# EAGLE design Lion1 (EAGLE 6.6.0)
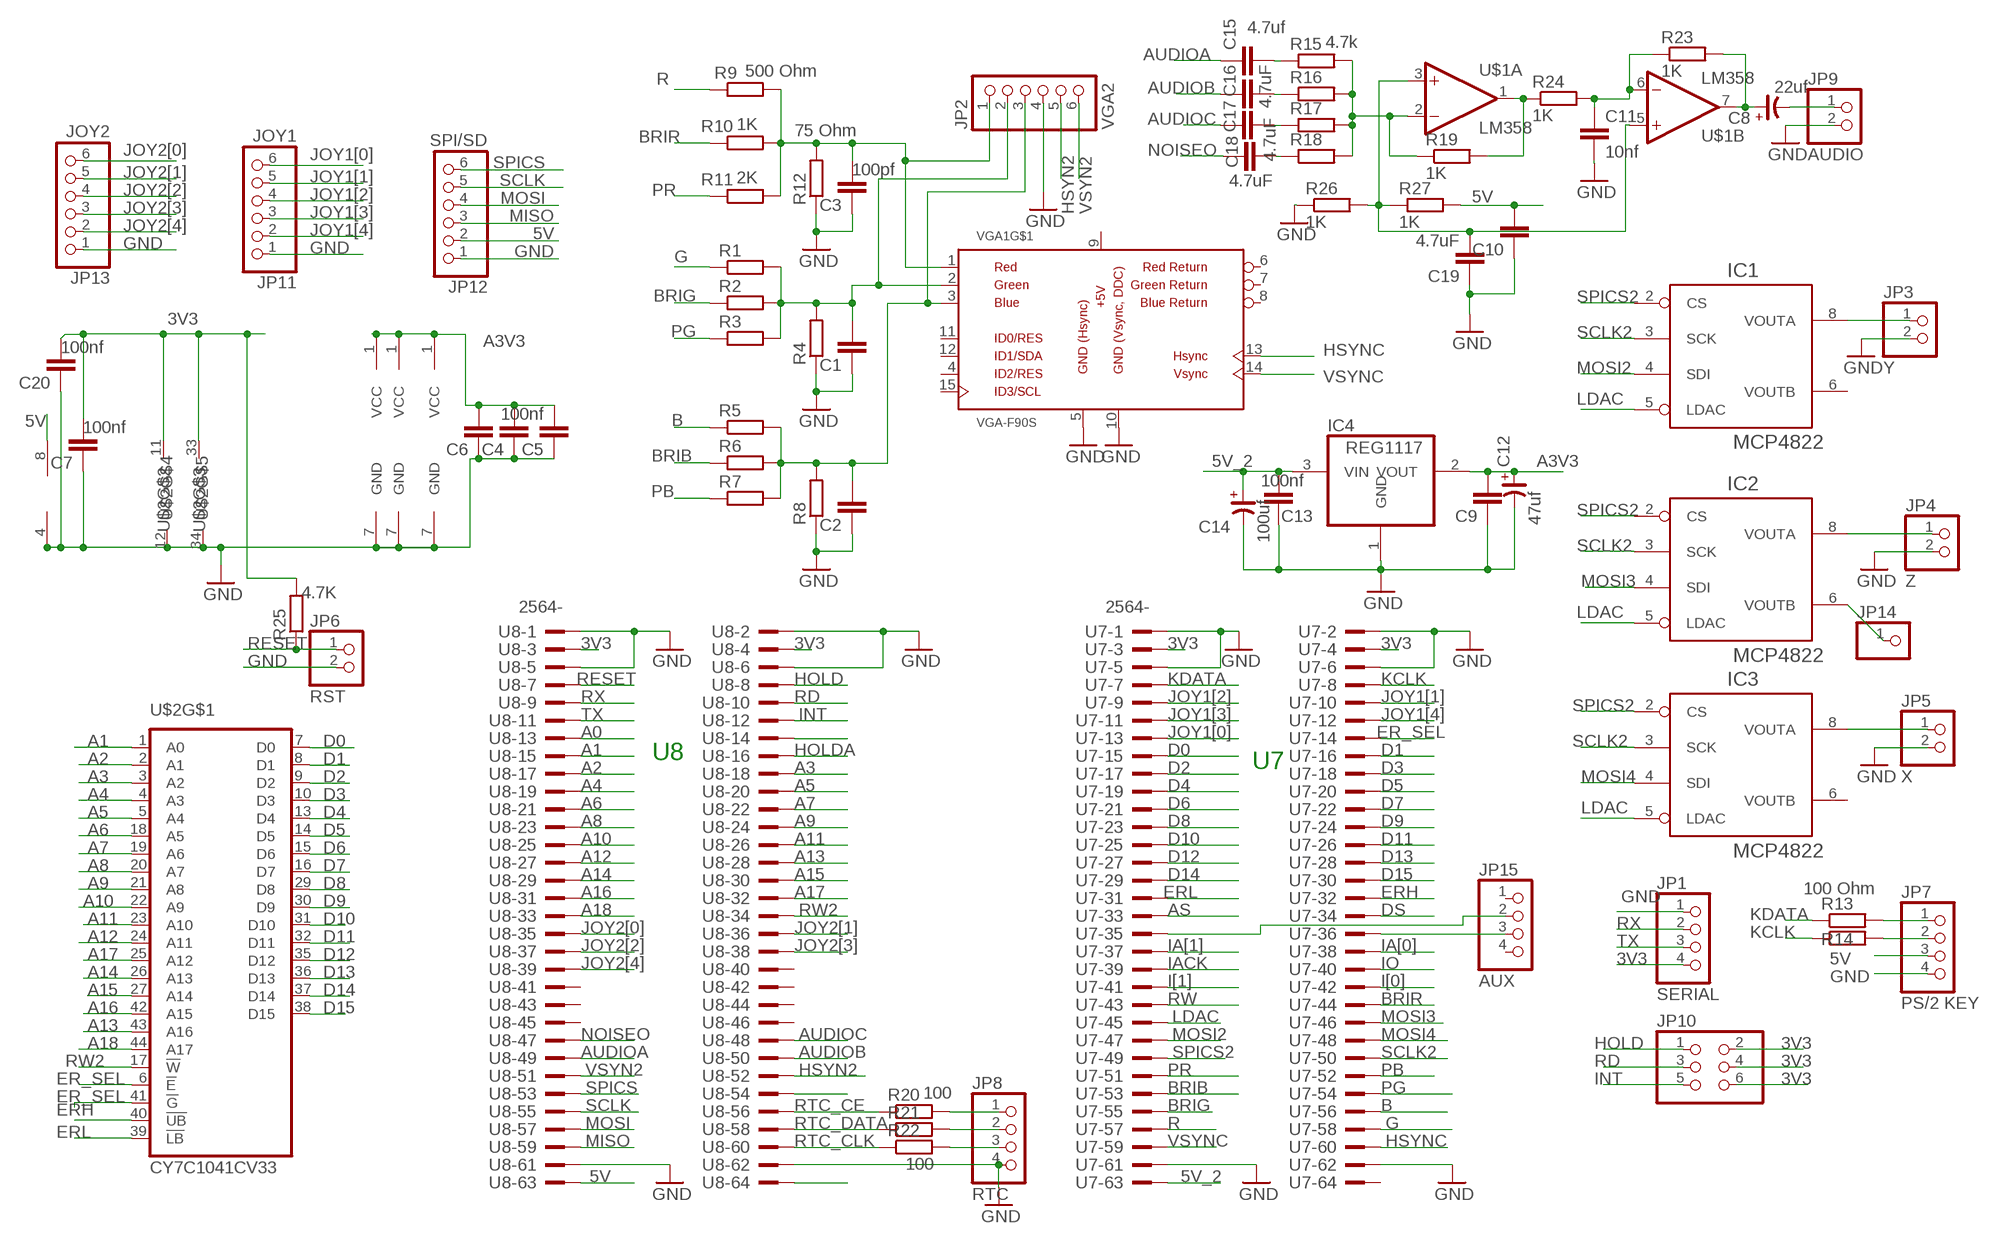
[diagram p0: schematic, sheet 1]

## Parts
C1  C-EU050-025X075  [C050-025X075]
C2  C-EU050-025X075  [C050-025X075]
C3  100pf  C-EU050-025X075  [C050-025X075]
C4  C-EU050-025X075  [C050-025X075]
C5  100nf  C-EU050-025X075  [C050-025X075]
C6  C-EU050-025X075  [C050-025X075]
C7  100nf  C-EUC0805  [C0805]
C8  22uf  CP_E-025X060  [CE-025X060]
C9  C-EU050-025X075  [C050-025X075]
C10  C-EU050-025X075  [C050-025X075]
C11  10nf  C-EU050-025X075  [C050-025X075]
C12  47uf  CP_E-025X060  [CE-025X060]
C13  100nf  C-EU050-025X075  [C050-025X075]
C14  100uf  CP_E-025X060  [CE-025X060]
C15  4.7uf  C-EU050-025X075  [C050-025X075]
C16  4.7uF  C-EU050-025X075  [C050-025X075]
C17  4.7uF  C-EU050-025X075  [C050-025X075]
C18  4.7uF  C-EU050-025X075  [C050-025X075]
C19  4.7uF  C-EU050-025X075  [C050-025X075]
C20  100nf  C-EUC0805  [C0805]
IC1  MCP4822  MCP42E-P  [DIL08]
IC2  MCP4822  MCP42E-P  [DIL08]
IC3  MCP4822  MCP42E-P  [DIL08]
IC4  REG1117  [SOT223]
JP1  SERIAL  PINHD-1X4  [1X04]
JP2  VGA2  PINHD-1X6  [1X06]
JP3  Y  PINHD-1X2  [1X02]
JP4  Z  PINHD-1X2  [1X02]
JP5  X  PINHD-1X2  [1X02]
JP6  RST  PINHD-1X2  [1X02]
JP7  PS/2 KEY  PINHD-1X4  [1X04]
JP8  RTC  PINHD-1X4  [1X04]
JP9  AUDIO  PINHD-1X2  [1X02]
JP10  PINHD-2X3  [2X03]
JP11  JOY1  PINHD-1X6  [1X06]
JP12  SPI/SD  PINHD-1X6  [1X06]
JP13  JOY2  PINHD-1X6  [1X06]
JP14  PINHD-1X1  [1X01]
JP15  AUX  PINHD-1X4  [1X04]
R1  R-EU_0204/7  [0204/7]
R2  R-EU_0204/7  [0204/7]
R3  R-EU_0204/7  [0204/7]
R4  R-EU_0204/7  [0204/7]
R5  R-EU_0204/7  [0204/7]
R6  R-EU_0204/7  [0204/7]
R7  R-EU_0204/7  [0204/7]
R8  R-EU_0204/7  [0204/7]
R9  500 Ohm  R-EU_0204/7  [0204/7]
R10  1K  R-EU_0204/7  [0204/7]
R11  2K  R-EU_0204/7  [0204/7]
R12  75 Ohm  R-EU_0204/7  [0204/7]
R13  100 Ohm  R-EU_0204/7  [0204/7]
R14  R-EU_0204/7  [0204/7]
R15  4.7k  R-EU_0204/2V  [0204V]
R16  R-EU_0204/2V  [0204V]
R17  R-EU_0204/2V  [0204V]
R18  R-EU_0204/2V  [0204V]
R19  1K  R-EU_0204/7  [0204/7]
R20  100  R-EU_0204/7  [0204/7]
R21  100  R-EU_0204/7  [0204/7]
R22  R-EU_0204/7  [0204/7]
R23  1K  R-EU_0204/7  [0204/7]
R24  1K  R-EU_0204/7  [0204/7]
R25  4.7K  R-EU_0204/5  [0204/5]
R26  1K  R-EU_0204/7  [0204/7]
R27  1K  R-EU_0204/7  [0204/7]
U7  2564-  [PAK100/2500-64]
U8  2564-  [PAK100/2500-64]
U$1  LM358  [DIL8]
U$2  CY7C1041CV33  [TSOP44-II]
VGA1  VGA-F90S  [DB-15-F90+SHIELD-SMALL_PADS]

## Nets
3V3: C7.2 C20.2 JP1.4 JP10.2 JP10.4 JP10.6 R25.2 U7.3 U7.4 U8.3 U8.4 U$2.11(VCC) U$2.33(VCC)
5V: C10.2 JP7.3 JP12.2 R27.2 U8.63 U$1.8(P:V+)
5V_2: C13.2 C14.+ IC4.3(VIN) U7.63
A0: U8.13
A1: U8.15 U$2.1(A0)
A2: U8.17 U$2.2(A1)
A3: U8.18 U$2.3(A2)
A3V3: C4.2 C5.2 C6.2 C9.2 C12.+ IC1.1(VCC) IC2.1(VCC) IC3.1(VCC) IC4.2(VOUT)
A4: U8.19 U$2.4(A3)
A5: U8.20 U$2.5(A4)
A6: U8.21 U$2.18(A5)
A7: U8.22 U$2.19(A6)
A8: U8.23 U$2.20(A7)
A9: U8.24 U$2.21(A8)
A10: U8.25 U$2.22(A9)
A11: U8.26 U$2.23(A10)
A12: U8.27 U$2.24(A11)
A13: U8.28 U$2.43(A16)
A14: U8.29 U$2.26(A13)
A15: U8.30 U$2.27(A14)
A16: U8.31 U$2.42(A15)
A17: U8.32 U$2.25(A12)
A18: U8.33 U$2.44(A17)
AS: U7.33
AUDIOA: C15.1 U8.49
AUDIOB: C16.1 U8.50
AUDIOC: C17.1 U8.48
B: R5.1 U7.56
BRIB: R6.1 U7.53
BRIG: R2.1 U7.55
BRIR: R10.1 U7.44
D0: U7.15 U$2.7(D0)
D1: U7.16 U$2.8(D1)
D2: U7.17 U$2.9(D2)
D3: U7.18 U$2.10(D3)
D4: U7.19 U$2.13(D4)
D5: U7.20 U$2.14(D5)
D6: U7.21 U$2.15(D6)
D7: U7.22 U$2.16(D7)
D8: U7.23 U$2.29(D8)
D9: U7.24 U$2.30(D9)
D10: U7.25 U$2.31(D10)
D11: U7.26 U$2.32(D11)
D12: U7.27 U$2.35(D12)
D13: U7.28 U$2.36(D13)
D14: U7.29 U$2.37(D14)
D15: U7.30 U$2.38(D15)
DS: U7.34
ER_SEL: U7.14 U$2.6(!E) U$2.41(!G)
ERH: U7.32 U$2.40(!UB)
ERL: U7.31 U$2.39(!LB)
G: R1.1 U7.58
GND: C1.1 C2.1 C3.1 C4.1 C5.1 C6.1 C7.1 C9.1 C10.1 C11.2 C12.- C13.1 C14.- C19.1 C20.1 IC1.7(GND) IC2.7(GND) IC3.7(GND) IC4.1(GND) JP1.1 JP2.4 JP3.2 JP4.2 JP5.2 JP6.2 JP7.4 JP8.4 JP9.2 JP11.1 JP12.1 JP13.1 R4.1 R8.1 R12.1 R26.1 U7.1 U7.2 U7.5 U7.6 U7.61 U7.62 U8.1 U8.2 U8.5 U8.6 U8.61 U8.62 U$1.4(P:V-) U$2.12(VSS) U$2.34(VSS) VGA1.5(GND) VGA1.10(GND)
HOLD: JP10.1 U8.8
HOLDA: U8.16
HSYN2: JP2.5 U8.52
HSYNC: U7.60 VGA1.13(VGA-HSYNC)
I[0]: U7.42
I[1]: U7.41
IA[0]: U7.38
IA[1]: U7.37
IACK: U7.39
INT: JP10.5 U8.12
IO: U7.40
JOY1[0]: JP11.6 U7.13
JOY1[1]: JP11.5 U7.10
JOY1[2]: JP11.4 U7.9
JOY1[3]: JP11.3 U7.11
JOY1[4]: JP11.2 U7.12
JOY2[0]: JP13.6 U8.35
JOY2[1]: JP13.5 U8.36
JOY2[2]: JP13.4 U8.37
JOY2[3]: JP13.3 U8.38
JOY2[4]: JP13.2 U8.39
KCLK: R14.1 U7.8
KDATA: R13.1 U7.7
LDAC: IC1.5(LDAC) IC2.5(LDAC) IC3.5(LDAC) U7.45
MISO: JP12.3 U8.59
MOSI: JP12.4 U8.57
MOSI2: IC1.4(SDI) U7.47
MOSI3: IC2.4(SDI) U7.46
MOSI4: IC3.4(SDI) U7.48
N$1: C1.2 JP2.2 R1.2 R2.2 R3.2 R4.2 VGA1.2(VGA-G)
N$2: IC2.6(VOUTB) JP14.1
N$3: C19.2 R26.2 R27.1 U$1.3(A:+IN) U$1.5(B:+IN)
N$4: C15.2 R15.1
N$5: IC3.8(VOUTA) JP5.1
N$6: C2.2 JP2.3 R5.2 R6.2 R7.2 R8.2 VGA1.3(VGA-B)
N$7: IC2.8(VOUTA) JP4.1
N$8: IC1.8(VOUTA) JP3.1
N$9: R15.2 R16.2 R17.2 R18.2 R19.1 U$1.2(A:-IN)
N$10: C3.2 JP2.1 R9.2 R10.2 R11.2 R12.2 VGA1.1(VGA-R)
N$11: R19.2 R24.1 U$1.1(A:OUT)
N$12: JP7.1 R13.2
N$13: JP7.2 R14.2
N$14: C8.- JP9.1
N$15: JP8.1 R20.2
N$17: JP8.2 R21.2
N$18: JP8.3 R22.2
N$19: C8.+ R23.2 U$1.7(B:OUT)
N$20: C11.1 R23.1 R24.2 U$1.6(B:-IN)
N$21: C16.2 R16.1
N$22: C17.2 R17.1
N$23: C18.2 R18.1
N$24: JP15.2 U7.35
N$47: U8.14
N$66: U8.54
N$70: U8.64
N$85: JP15.3 U7.36
NOISEO: C18.1 U8.47
PB: R7.1 U7.52
PG: R3.1 U7.54
PR: R11.1 U7.51
R: R9.1 U7.57
RD: JP10.3 U8.10
RESET: JP6.1 R25.1 U8.7
RTC_CE: R20.1 U8.56
RTC_CLK: R22.1 U8.60
RTC_DATA: R21.1 U8.58
RW: U7.43
RW2: U8.34 U$2.17(!W)
RX: JP1.2 U8.9
SCLK: JP12.5 U8.55
SCLK2: IC1.3(SCK) IC2.3(SCK) IC3.3(SCK) U7.50
SPICS: JP12.6 U8.53
SPICS2: IC1.2(CS) IC2.2(CS) IC3.2(CS) U7.49
TX: JP1.3 U8.11
VSYN2: JP2.6 U8.51
VSYNC: U7.59 VGA1.14(VGA-VSYNC)
Unconnected: IC1.6(VOUTB) IC3.6(VOUTB) JP15.1 JP15.4 U7.64 U8.40 U8.41 U8.42 U8.43 U8.44 U8.45 U8.46 VGA1.4(ID2/RES) VGA1.6(VGA-R-) VGA1.7(VGA-G-) VGA1.8(VGA-B-) VGA1.11(ID0/RES) VGA1.12(ID1/SDA) VGA1.15(ID3/SCL) VGA1.SHIELD@1(SHIELD) VGA1.SHIELD@2(SHIELD)

## Notes on the sheet
- U8
- U7

## Power pins joined to a net without a drawn wire
+5V: VGA1.9(+5V)

## Library data of the parts
C1-C7 C9-C11 C13 C15-C20 = rcl:C-EU: CAPACITOR, European symbol
C8 C12 C14 = rc-master:CP_: POLARIZED CAP
IC1-IC3 = dac:MCP4*2: DAC 8BIT DUAL SPI/VREF
IC4 = burr-brown:REG1117: 800mA and 1A Low Dropout (LDO) Positive Regulator 1.8V, 2.5V, 2.85V, 3.3V, 5V, and Adj; MPN: REG1117; OC_FARNELL: 1097566; OC_NEWARK: 14P6981
JP1 JP7 JP8 JP15 = pinhead:PINHD-1X4: PIN HEADER
JP2 JP11-JP13 = pinhead:PINHD-1X6: PIN HEADER
JP3-JP6 JP9 = pinhead:PINHD-1X2: PIN HEADER
JP10 = pinhead:PINHD-2X3: PIN HEADER
JP14 = pinhead:PINHD-1X1: PIN HEADER
R1-R12 R25 = rcl:R-EU_: RESISTOR, European symbol
R13-R24 R26 R27 = SmartPrj:R-EU_: RESISTOR, European symbol
U7 U8 = con-3m:2564-: 3M (TM) Pak 100 4-Wall Header Source: 3M; OC_FARNELL: unknown; OC_NEWARK: unknown
U$1 = eagle-6.5.0-atari:LM358: Dual General Purpose, Rail-to-Rail Output Operational Amplifier
U$2 = st-microelectronics:CY7C1041CV33
VGA1 = VideoConnectors:VGA-*

## Board
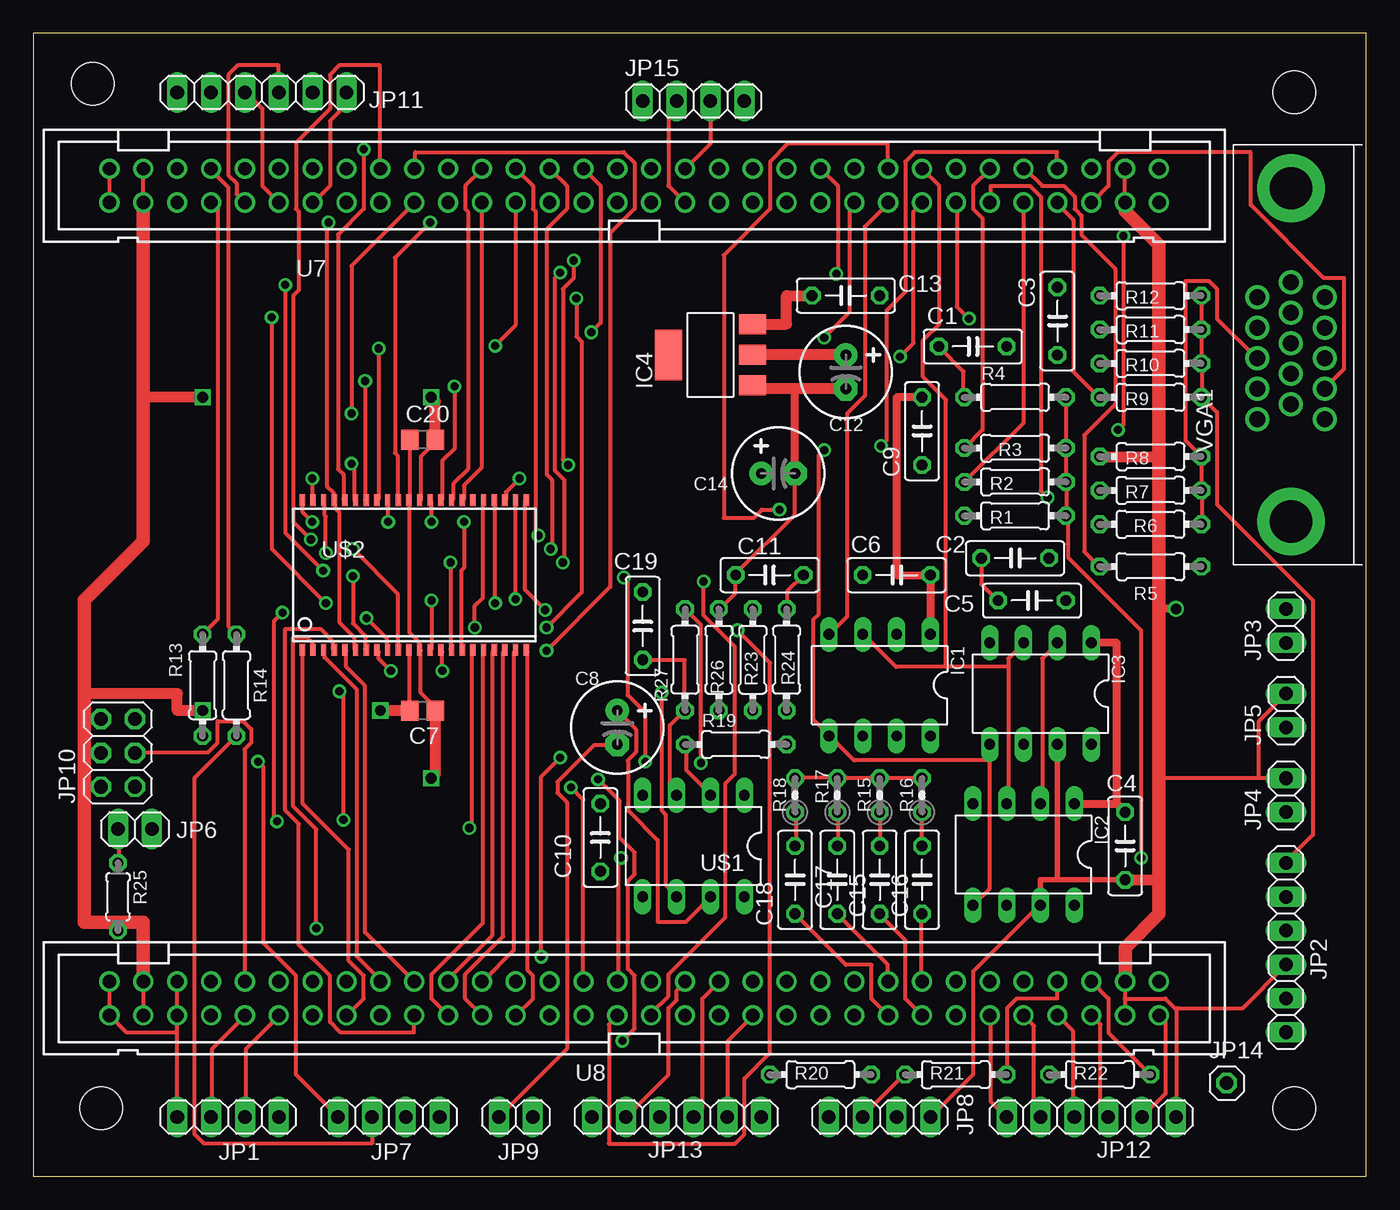
[diagram p1: board, top side]
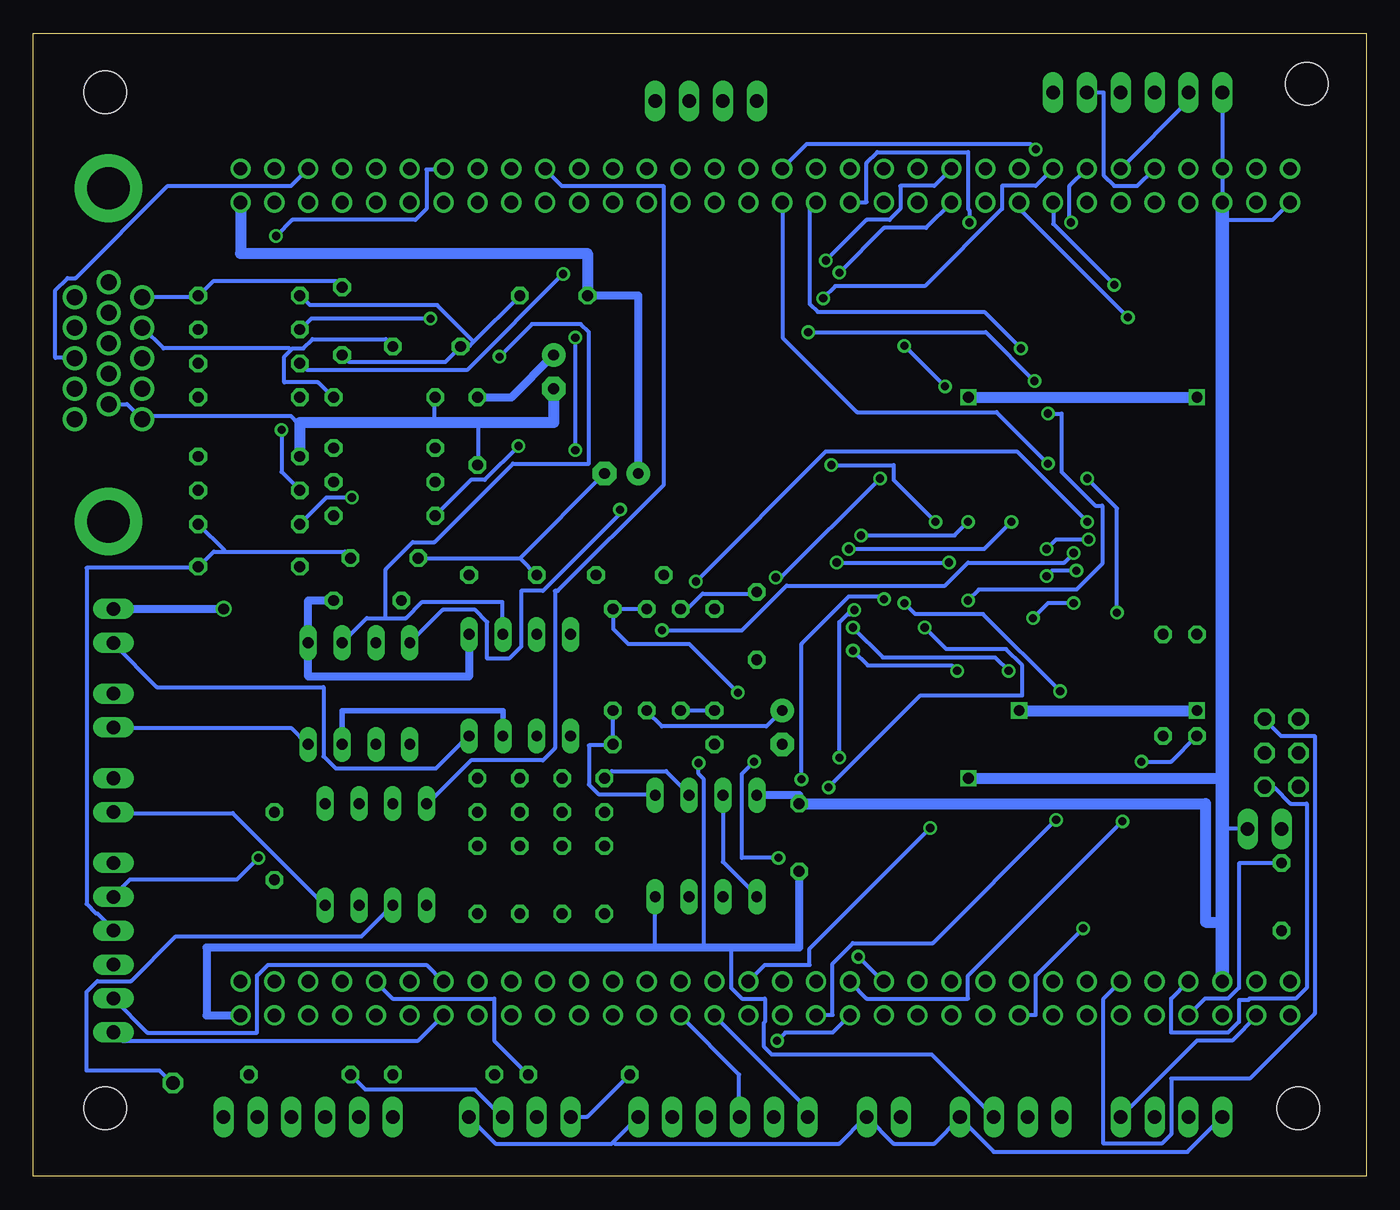
[diagram p2: board, bottom side, seen from below]

Size 100 x 85.72 mm. Coordinates in mm from the lower left corner, seen from the top.
Outline: 0,0 100,0 100,85.72 0,85.72 0,0
Copper layers (1*16): Top 0.035mm / dielectric 1.5mm / Bottom 0.035mm
Design rules "default *": minimum track width 12mil, minimum drill 24mil, track to track 12mil, track to pad 12mil, pad to pad 12mil, via to via 12mil, smd to smd 6mil, copper to edge 40mil, drill to drill 16mil, minimum pad ring 10mil, minimum via ring 8mil, stop-mask expansion 4mil, vias tented up to drill 0mil, thermal gap 10mil
Holes 3.2 mm at 94.61,81.28 94.61,5.08 4.45,81.92 5.08,5.08

### Footprints (pad centres in the part's own frame; a part is rotated, then mirrored left to right if it is on the bottom)
C050-025X075 = drill 0.813 octagon: 1 -2.54,0; 2 2.54,0
C0805 = smd 1.3 x 1.5: 1 -0.95,0; 2 0.95,0
CE-025X060 = drill 0.813 pad 1.778: + -1.27,0 | drill 0.813 pad 1.778 octagon: - 1.27,0
DIL08 = drill 0.813 long: 1 -3.81,-3.81; 2 -1.27,-3.81; 3 1.27,-3.81; 4 3.81,-3.81; 5 3.81,3.81; 6 1.27,3.81; 7 -1.27,3.81; 8 -3.81,3.81
SOT223 = smd 1.499 x 2.007: 1 -2.261,-3.15; 2 0.025,-3.15; 3 2.311,-3.15 | smd 3.81 x 2.007: 4 0,3.15
1X04 = drill 1.016 long: 1 -3.81,0; 2 -1.27,0; 3 1.27,0; 4 3.81,0
1X06 = drill 1.016 long: 1 -6.35,0; 2 -3.81,0; 3 -1.27,0; 4 1.27,0; 5 3.81,0; 6 6.35,0
1X02 = drill 1.016 long: 1 -1.27,0; 2 1.27,0
2X03 = drill 1.016 octagon: 1 -2.54,-1.27; 2 -2.54,1.27; 3 0,-1.27; 4 0,1.27; 5 2.54,-1.27; 6 2.54,1.27
1X01 = drill 1.016 octagon: 1 0,0
0204/7 = drill 0.813 octagon: 1 -3.81,0; 2 3.81,0
0204V = drill 0.813 octagon: 1 -1.27,0; 2 1.27,0
0204/5 = drill 0.813 octagon: 1 -2.54,0; 2 2.54,0
PAK100/2500-64 = drill 1 pad 1.422: 1 -39.37,-1.27; 2 -39.37,1.27; 3 -36.83,-1.27; 4 -36.83,1.27; 5 -34.29,-1.27; 6 -34.29,1.27; 7 -31.75,-1.27; 8 -31.75,1.27; 9 -29.21,-1.27; 10 -29.21,1.27; 11 -26.67,-1.27; 12 -26.67,1.27; 13 -24.13,-1.27; 14 -24.13,1.27; 15 -21.59,-1.27; 16 -21.59,1.27; 17 -19.05,-1.27; 18 -19.05,1.27; 19 -16.51,-1.27; 20 -16.51,1.27; 21 -13.97,-1.27; 22 -13.97,1.27; 23 -11.43,-1.27; 24 -11.43,1.27; 25 -8.89,-1.27; 26 -8.89,1.27; 27 -6.35,-1.27; 28 -6.35,1.27; 29 -3.81,-1.27; 30 -3.81,1.27; 31 -1.27,-1.27; 32 -1.27,1.27; 33 1.27,-1.27; 34 1.27,1.27; 35 3.81,-1.27; 36 3.81,1.27; 37 6.35,-1.27; 38 6.35,1.27; 39 8.89,-1.27; 40 8.89,1.27; 41 11.43,-1.27; 42 11.43,1.27; 43 13.97,-1.27; 44 13.97,1.27; 45 16.51,-1.27; 46 16.51,1.27; 47 19.05,-1.27; 48 19.05,1.27; 49 21.59,-1.27; 50 21.59,1.27; 51 24.13,-1.27; 52 24.13,1.27; 53 26.67,-1.27; 54 26.67,1.27; 55 29.21,-1.27; 56 29.21,1.27; 57 31.75,-1.27; 58 31.75,1.27; 59 34.29,-1.27; 60 34.29,1.27; 61 36.83,-1.27; 62 36.83,1.27; 63 39.37,-1.27; 64 39.37,1.27
DIL8 = drill 0.813 long: 1 -3.81,-3.81; 2 -1.27,-3.81; 3 1.27,-3.81; 4 3.81,-3.81; 5 3.81,3.81; 6 1.27,3.81; 7 -1.27,3.81; 8 -3.81,3.81
TSOP44-II = smd 0.4 x 0.9: 1 -8.4,-5.6; 2 -7.6,-5.6; 3 -6.8,-5.6; 4 -6,-5.6; 5 -5.2,-5.6; 6 -4.4,-5.6; 7 -3.6,-5.6; 8 -2.8,-5.6; 9 -2,-5.6; 10 -1.2,-5.6; 11 -0.4,-5.6; 12 0.4,-5.6; 13 1.2,-5.6; 14 2,-5.6; 15 2.8,-5.6; 16 3.6,-5.6; 17 4.4,-5.6; 18 5.2,-5.6; 19 6,-5.6; 20 6.8,-5.6; 21 7.6,-5.6; 22 8.4,-5.6; 23 8.4,5.6; 24 7.6,5.6; 25 6.8,5.6; 26 6,5.6; 27 5.2,5.6; 28 4.4,5.6; 29 3.6,5.6; 30 2.8,5.6; 31 2,5.6; 32 1.2,5.6; 33 0.4,5.6; 34 -0.4,5.6; 35 -1.2,5.6; 36 -2,5.6; 37 -2.8,5.6; 38 -3.6,5.6; 39 -4.4,5.6; 40 -5.2,5.6; 41 -6,5.6; 42 -6.8,5.6; 43 -7.6,5.6; 44 -8.4,5.6
DB-15-F90+SHIELD-SMALL_PADS = drill 1.2 pad 1.524: 1 4.318,14.224; 2 2.032,14.224; 3 -0.254,14.224; 4 -2.54,14.224; 5 -4.826,14.224; 6 5.461,11.684; 7 3.175,11.684; 8 0.889,11.684; 9 -1.397,11.684; 10 -3.683,11.684; 11 4.318,9.144; 12 2.032,9.144; 13 -0.254,9.144; 14 -2.54,9.144; 15 -4.826,9.144 | drill 3.175 pad 5.08: SHIELD@1 -12.497,11.684; SHIELD@2 12.497,11.684

### Placement (x,y rotation side)
C1  70.48,62.23 0 top
C2  73.66,46.35 0 top
C3  76.83,64.14 90 top
C4  81.92,24.77 90 top
C5  74.93,43.18 0 top
C6  64.77,45.09 0 top
C7  29.21,34.92 180 top
C8  43.81,33.66 270 top
C9  66.67,55.88 90 top
C10  42.55,25.4 270 top
C11  55.24,45.09 180 top
C12  60.96,60.33 270 top
C13  60.96,66.04 180 top
C14  55.88,52.7 0 top
C15  63.5,22.23 90 top
C16  66.67,22.23 90 top
C17  60.33,22.23 90 top
C18  57.15,22.23 90 top
C19  45.72,41.27 270 top
C20  29.21,55.24 0 top
IC1  63.5,36.83 180 top
IC2  74.3,24.13 180 top
IC3  75.56,36.2 180 top
IC4  50.8,61.59 90 top
JP1  14.61,4.45 0 top
JP2  93.98,17.14 270 top
JP3  93.98,41.27 90 top
JP4  93.98,28.57 90 top
JP5  93.98,34.92 90 top
JP6  7.62,26.04 0 top
JP7  26.67,4.45 0 top
JP8  63.5,4.45 0 top
JP9  36.2,4.45 0 top
JP10  6.35,31.75 90 top
JP11  17.14,81.28 0 top
JP12  79.38,4.45 180 top
JP13  48.26,4.45 180 top
JP14  89.53,6.99 0 top
JP15  49.53,80.64 0 top
R1  73.66,49.53 0 top
R2  73.66,52.07 0 top
R3  73.66,54.61 0 top
R4  73.66,58.42 0 top
R5  83.82,45.72 0 top
R6  83.82,48.9 0 top
R7  83.82,51.44 0 top
R8  83.82,53.98 0 top
R9  83.82,58.42 0 top
R10  83.82,60.96 0 top
R11  83.82,63.5 0 top
R12  83.82,66.04 0 top
R13  12.7,36.83 270 top
R14  15.24,36.83 270 top
R15  63.5,28.57 90 top
R16  66.67,28.57 90 top
R17  60.33,28.57 90 top
R18  57.15,28.57 90 top
R19  52.7,32.38 0 top
R20  59.05,7.62 180 top
R21  69.22,7.62 180 top
R22  80.01,7.62 180 top
R23  53.98,38.73 270 top
R24  56.52,38.73 90 top
R25  6.35,20.95 270 top
R26  51.44,38.73 270 top
R27  48.9,38.73 90 top
U7  45.09,74.3 0 top
U8  45.09,13.34 0 top
U$1  49.53,24.77 180 top
U$2  28.57,45.09 0 top
VGA1  106.05,61.59 90 top

### Tracks (layer width: path | path; a pad name or v marks a point on that pad's centre or on a via)
3V3  (via drill 0.8)
  Top 0.305: U$2.11 28.25,39.42 28.25,35.26 C7.2 | U$2.33 29.06,50.7 29.06,53.95 29.97,54.86 C20.2 | R25.2 6.4,18.49 6.4,19.05 | U8.3 8.23,12.09 8.23,14.12 U8.4 | U7.4 8.23,75.49 8.23,73.46 U7.3 | 3.81,29.26 5.08,29.26 JP10.2 | 3.81,31.8 5.08,31.8 JP10.4 | 3.81,34.34 5.08,34.34 JP10.6
  Top 0.813: C7.2 v26.04,34.92 | C20.2 30.16,58.1 v29.84,58.42 | v12.7,34.92 10.79,34.92 10.79,36.2 3.81,36.2 | v12.7,58.42 8.26,58.42
  Top 1.016: U8.4 8.26,19.05 6.4,19.05 3.81,19.05 3.81,29.26 3.81,31.8 3.81,34.34 3.81,36.2 3.81,43.18 8.26,47.62 8.26,58.42 U7.3
  Bottom 0.305: JP1.4 12.7,10.16 10.06,10.16 8.23,11.99 U8.3
  Bottom 0.813: v26.04,34.92 v12.7,34.92 | v29.84,58.42 v12.7,58.42
5V  (via drill 0.61)
  Top 0.305: R27.2 50.09,41.35 v50.09,30.99 | JP12.2 84.94,6.2 84.94,11.58 U8.63
  Bottom 0.305: 53.34,17.14 U$1.8 | v50.09,30.99 50.09,30.18 49.68,29.77 49.68,17.14 | 47.65,17.14 47.65,14.12 46.84,13.31 45.11,13.31 45.11,11.58 45.21,11.48 45.21,9.75 44.6,9.14 32.61,9.14 27.94,4.47 JP7.3
  Bottom 0.61: C10.2 42.55,17.14 47.65,17.14 49.68,17.14 53.34,17.14 87,17.14 87,12.06 U8.63
5V_2
  Top 0.813: IC4.3 56.52,63.91 56.52,66.04 C13.2
  Bottom 0.61: C14.+ 54.61,66.04 C13.2
  Bottom 0.813: U7.63 84.45,69.22 58.42,69.22 C13.2
A1
  Top 0.305: U$2.1 20.22,39.42 20.22,27.94 23.67,24.49 23.67,16.15 24.79,15.04 24.79,13.31 23.57,12.09 U8.15
A2  (via drill 0.61)
  Top 0.305: v21.23,18.59 21.23,26.01 19.51,27.74 19.51,40.44 20.52,40.44 20.93,40.03 20.93,39.52 U$2.2
  Bottom 0.305: v21.23,18.59 24.79,15.04 24.79,12.09 26.01,12.09 U8.17
A3
  Top 0.305: U$2.3 21.84,39.42 21.84,38.91 24.28,36.47 24.28,16.46 26.01,14.73 26.01,14.63 U8.18
A3V3
  Top 0.61: C4.2 81.28,27.94 | 81.28,27.94 81.28,40.01 IC3.1 | C9.2 64.77,58.42 64.77,45.09 C6.2 IC1.1 | IC2.1 81.28,27.94
  Top 0.813: C12.+ 60.3,61.59 IC4.2
  Bottom 0.61: C5.2 79.38,43.18 IC3.1 79.38,37.47 67.31,37.47 IC1.1 | C9.2 64.14,58.42 C12.+
A4
  Top 0.305: U$2.4 22.55,39.52 22.45,39.62 22.45,40.13 21.54,41.05 18.9,41.05 18.9,27.43 19.91,26.42 19.91,17.37 22.25,15.04 22.25,11.58 23.06,10.77 28.55,10.77 28.55,11.99 U8.19
A5
  Top 0.305: U8.20 24.89,18.29 24.89,36.78 23.47,38.2 23.47,39.42 U$2.5
A6
  Top 0.305: U8.21 29.87,13.31 29.87,15.14 33.73,19 33.73,39.42 U$2.18
A7
  Top 0.305: U$2.19 34.54,39.42 34.44,39.32 34.44,18.09 31.19,14.83 31.19,14.63 U8.22
A8
  Top 0.305: U8.23 32.41,13.31 32.41,15.14 35.26,17.98 35.26,39.32 35.36,39.42 U$2.20
A9
  Top 0.305: U$2.21 36.17,39.42 36.07,39.32 36.07,16.97 33.73,14.63 U8.24
A10
  Top 0.305: U$2.22 36.98,39.42 37.08,39.32 37.08,15.44 37.49,15.04 37.49,13.31 36.27,12.09 U8.25
A11  (via drill 0.61)
  Top 0.305: v38.41,42.47 36.88,43.99 36.88,50.6 U$2.23 | v39.52,31.39 38.1,29.97 v38.1,16.46
  Bottom 0.305: v38.41,42.47 38.71,42.16 38.91,42.16 39.52,41.55 v39.52,31.39 | v38.1,16.46 36.27,14.63 U8.26
A12  (via drill 0.61)
  Top 0.305: v36.17,43.28 36.17,50.6 U$2.24 | v42.37,29.77 43.99,28.14 43.99,25.4 45.11,24.28 45.11,22.66 44.6,22.15 44.6,15.54 45.11,15.04 45.11,11.07 v44.2,10.16
  Bottom 0.305: v36.17,43.28 36.37,43.48 38.81,43.48 42.37,39.93 v42.37,29.77 | v44.2,10.16 43.59,10.77 40.03,10.77 U8.27
A13  (via drill 0.61)
  Top 0.305: v20.93,52.32 20.93,50.7 U$2.43 | v18.69,42.27 18.09,41.66 18.09,26.82 v18.29,26.62
  Bottom 0.305: v20.93,52.32 18.69,50.09 v18.69,42.27 | v18.29,26.62 29.87,15.04 29.87,13.31 37.49,13.31 38.71,14.53 U8.28
A14  (via drill 0.61)
  Top 0.305: v34.65,42.98 34.65,50.6 U$2.26 | v22.96,36.37 23.27,36.07 v23.27,26.72
  Bottom 0.305: v34.65,42.98 33.83,42.16 28.75,42.16 v22.96,36.37 | v23.27,26.72 32.51,17.48 38.51,17.48 40.03,15.95 40.03,12.09 41.25,12.09 U8.29
A15  (via drill 0.61)
  Top 0.305: v33.12,41.15 33.12,42.77 33.73,43.38 33.73,50.6 U$2.27 | v40.34,29.16 41.25,28.25 41.25,14.63 U8.30
  Bottom 0.305: v33.12,41.15 31.5,39.52 27.03,39.52 25.81,38.3 25.81,36.07 33.43,36.07 v40.34,29.16
A16  (via drill 0.61)
  Top 0.305: v21.95,46.74 21.95,49.48 21.84,49.58 21.84,50.6 U$2.42 | v52.83,40.95 55.27,38.51 55.27,9.25 53.34,7.32 53.34,3.15 52.63,2.44 43.18,2.44 43.18,11.38 43.79,11.99 U8.31
  Bottom 0.305: v21.95,46.74 22.66,46.02 29.87,46.02 31.6,44.3 43.48,44.3 46.84,40.95 v52.83,40.95
A17  (via drill 0.61)
  Top 0.305: v36.47,52.32 35.46,51.31 35.46,50.7 U$2.25 | v44.3,44.91 44.6,44.6 44.6,36.07 45.92,34.75 v45.92,31.09 | v44.09,23.88 43.89,23.67 43.89,14.63 U8.32
  Bottom 0.305: v36.47,52.32 43.89,44.91 v44.3,44.91 | v45.92,31.09 46.84,30.18 46.84,23.88 v44.09,23.88
A18  (via drill 0.61)
  Top 0.305: v20.93,49.07 20.22,49.78 20.22,50.6 U$2.44 | v50.29,44.6 50.29,42.06 52.63,39.73 52.63,30.18 51.92,29.46 51.92,19.41 47.65,15.14 47.65,13.51 46.43,12.29 46.43,12.09 U8.33
  Bottom 0.305: v20.93,49.07 26.21,54.36 40.54,54.36 v50.29,44.6
AUDIOA
  Top 0.305: U8.49 65.43,13.31 65.43,17.68 63.5,19.61 C15.1
AUDIOB
  Top 0.305: C16.1 66.65,19.61 66.65,14.63 U8.50
AUDIOC
  Top 0.305: C17.1 60.35,19.61 64.11,15.85 64.11,14.63 U8.48
B
  Top 0.305: R5.1 79.96,45.72 78.84,46.84 78.84,55.58 81.18,57.91 81.18,68.07 78.64,70.61 78.64,72.03 78.13,72.54 78.13,73.46 77.32,74.27 75.69,74.27 74.37,75.59 U7.56
BRIB  (via drill 0.61)
  Top 0.305: v76.1,50.9 75.59,51.41 75.59,73.46 74.78,74.27 71.83,74.27 71.83,73.05 U7.53
  Bottom 0.305: v76.1,50.9 78.03,50.9 79.96,48.97 R6.1
BRIG
  Top 0.305: R2.1 74.27,56.49 74.27,72.95 U7.55
BRIR  (via drill 0.61)
  Top 0.305: v60.25,67.67 60.35,67.77 60.35,74.27 U7.44
  Bottom 0.305: v60.25,67.67 67.46,60.45 79.45,60.45 79.96,60.96 R10.1
D0  (via drill 0.61)
  Top 0.305: v23.98,45.01 23.98,41.45 24.89,40.54 24.89,39.52 U$2.7 | v21.74,45.41 18.9,48.26 v18.9,66.85
  Bottom 0.305: v23.98,45.01 23.57,45.41 v21.74,45.41 | v18.9,66.85 23.47,71.42 23.47,72.95 U7.15
D1  (via drill 0.61)
  Top 0.305: v26.82,37.9 25.91,38.81 25.91,39.32 25.81,39.42 U$2.8 | v38.51,41.15 41.15,43.79 41.15,62.59 40.74,62.99 v40.74,65.84
  Bottom 0.305: v26.82,37.9 27.84,38.91 36.27,38.91 v38.51,41.15 | v40.74,65.84 39.83,66.75 33.12,66.75 27.33,72.54 27.33,74.27 24.79,74.27 U7.16
D2  (via drill 0.61)
  Top 0.305: v24.99,41.86 26.52,40.34 26.52,39.52 U$2.9 | v21.95,42.98 17.88,47.04 v17.88,64.41
  Bottom 0.305: v24.99,41.86 23.88,42.98 v21.95,42.98 | v17.88,64.41 26.01,72.54 26.01,72.95 U7.17
D3  (via drill 0.61)
  Top 0.305: v23.98,47.04 27.33,43.69 27.33,39.52 U$2.10 | v20.83,47.75 19.51,49.07 19.51,66.04 19.91,66.45 19.91,72.34 19.71,72.54 19.71,77.52 22.25,80.06 22.25,82.6 22.96,83.31 26.01,83.31 26.01,75.59 U7.18
  Bottom 0.305: v23.98,47.04 23.27,47.75 v20.83,47.75
D4  (via drill 0.61)
  Top 0.305: v29.87,43.18 29.87,39.52 U$2.13 | v23.88,57.2 23.88,68.28 28.55,72.95 U7.19
  Bottom 0.305: v29.87,43.18 29.06,43.99 21.74,43.99 19.81,45.92 19.81,50.29 20.32,50.29 22.86,52.83 22.86,57.2 v23.88,57.2
D5  (via drill 0.61)
  Top 0.305: v30.68,37.9 30.68,39.32 30.58,39.42 U$2.14 | v38.51,39.42 43.28,44.2 43.28,70.71 45.11,72.54 45.11,76 44.3,76.81 28.65,76.81 28.65,75.59 U7.20
  Bottom 0.305: v30.68,37.9 31.09,38.3 37.39,38.3 v38.51,39.42
D6  (via drill 0.61)
  Top 0.305: v31.29,46.02 31.29,39.52 U$2.15 | v39.73,46.02 39.83,46.13 39.83,52.22 39.12,52.93 39.12,67.36 v39.52,67.77
  Bottom 0.305: v39.73,46.02 v31.29,46.02 | v39.52,67.77 36.17,71.12 33.02,71.12 U7.21
D7  (via drill 0.61)
  Top 0.305: v32.31,49.07 32.31,45.62 32.11,45.41 32.11,39.52 U$2.16 | v40.13,53.34 39.73,53.75 39.73,66.55 40.54,67.36 v40.54,68.68
  Bottom 0.305: v32.31,49.07 35.46,52.22 35.46,53.34 v40.13,53.34 | v40.54,68.68 37.49,71.73 35.76,71.73 34.95,72.54 34.95,74.27 32.41,74.27 U7.22
D8
  Top 0.305: U$2.29 32.21,50.7 32.31,50.8 32.31,51.82 33.63,53.14 33.63,72.95 U7.23
D9
  Top 0.305: U$2.30 31.39,50.7 31.5,50.8 31.5,51.92 32.61,53.03 32.61,72.34 32.41,72.54 32.41,74.27 33.63,75.49 U7.24
D10  (via drill 0.61)
  Top 0.305: v31.6,59.23 31.6,54.56 30.68,53.65 30.68,50.8 30.58,50.7 U$2.31 | v34.65,62.28 36.17,63.8 36.17,72.95 U7.25
  Bottom 0.305: v34.65,62.28 v31.6,59.23
D11  (via drill 0.61)
  Top 0.305: v29.87,49.07 29.87,50.6 U$2.32 | v37.9,48.06 37.69,48.26 37.69,72.34 37.49,72.54 37.49,74.27 U7.26
  Bottom 0.305: v29.87,49.07 30.89,48.06 v37.9,48.06
D12  (via drill 0.61)
  Top 0.305: v29.77,71.53 27.13,68.89 27.13,54.25 27.33,54.05 27.33,50.7 U$2.35
  Bottom 0.305: v29.77,71.53 29.77,72.44 29.87,72.54 29.87,76.81 36.68,76.81 37.49,76 37.49,73.05 38.71,73.05 U7.27
D13  (via drill 0.61)
  Top 0.305: v26.62,49.07 26.62,50.6 U$2.36 | v38.81,47.04 38.91,47.14 38.91,52.22 38.51,52.63 38.51,71.02 40.03,72.54 40.03,74.27 U7.28
  Bottom 0.305: v26.62,49.07 28.65,47.04 v38.81,47.04
D14  (via drill 0.61)
  Top 0.305: v25.91,62.08 25.91,50.8 25.81,50.7 U$2.37
  Bottom 0.305: v25.91,62.08 28.65,64.82 41.15,64.82 41.76,65.43 41.76,72.95 41.35,72.95 U7.29
D15  (via drill 0.61)
  Top 0.305: v24.89,59.64 24.89,50.7 U$2.38 | v41.86,63.3 42.57,64.01 42.57,74.27 U7.30
  Bottom 0.305: v24.89,59.64 28.55,63.3 v41.86,63.3
ER_SEL  (via drill 0.61)
  Top 0.305: U$2.6 24.08,39.52 24.08,40.44 22.96,41.55 22.96,49.78 22.66,50.09 22.66,50.6 U$2.41 22.55,50.8 22.55,51.21 22.05,51.71 22.05,71.42 v22.15,71.53
  Bottom 0.305: U7.14 22.25,74.27 22.25,71.53 v22.15,71.53
ERH  (via drill 0.61)
  Top 0.305: v24.79,77.01 24.79,72.54 22.86,70.61 22.86,53.03 23.27,52.63 23.27,50.8 23.37,50.7 U$2.40
  Bottom 0.305: v24.79,77.01 25.2,77.42 41.96,77.42 U7.32
ERL  (via drill 0.61)
  Top 0.305: v23.88,53.44 24.08,53.24 24.08,50.7 U$2.39
  Bottom 0.305: v23.88,53.44 27.74,57.3 38.2,57.3 43.79,62.89 43.79,72.95 U7.31
G  (via drill 0.61)
  Top 0.305: v63.6,54.76 64.01,55.17 64.01,64.92 65.43,66.34 65.43,76.1 66.14,76.81 76.81,76.81 76.81,75.59 U7.58
  Bottom 0.305: R1.1 67.16,52.22 66.14,52.22 v63.6,54.76
GND  (via drill 0.8, 0.8 pad 1.02)
  Top 0.305: U7.1 5.69,73.05 5.69,75.49 U7.2 | U8.2 5.69,14.53 5.69,12.09 U8.1 7.01,10.77 10.77,10.77 | C20.1 28.25,55.17 28.25,50.7 U$2.34 28.25,50.6 28.25,40.74 28.96,40.03 28.96,39.62 U$2.12 29.06,39.42 29.06,36.27 29.97,35.36 29.97,35.26 C7.1 | U8.6 10.77,14.53 10.77,12.09 U8.5 10.77,11.99 10.77,10.77 | 10.77,10.77 10.77,4.47 JP1.1 | C2.1 71.12,44.4 72.34,43.18 C5.1 | R26.1 51.51,42.57 52.63,43.69 52.63,45.01 C11.2 52.73,45.21 57.1,49.58 57.1,52.43 C14.- | C1.1 67.97,62.18 69.8,60.35 69.8,58.42 R4.1 | 81.89,13.31 81.89,14.12 U8.62 | 81.89,13.31 81.89,12.09 U8.61 | U7.62 81.89,75.49 81.89,73.46 U7.61 | 85.75,12.5 85.75,4.47 JP12.1 | 85.75,12.5 84.94,13.31 81.89,13.31 | JP2.4 93.98,15.85 90.73,12.6 85.85,12.6 85.75,12.5 | 84.45,29.87 91.95,29.87 | 91.95,29.87 93.98,29.87 JP4.2 | 91.95,29.87 91.95,34.14 93.98,36.17 JP5.2 | JP8.4 67.36,4.47 70.51,7.62 70.51,15.34 75.39,20.22 IC2.7
  Top 0.406: C4.1 76.83,22.23 | 76.83,22.23 IC3.7 | 76.83,22.23 75.56,22.23 IC2.7
  Top 0.61: C14.- 57.15,59.05 | v85.72,42.55 84.45,42.55
  Top 0.813: C4.1 84.45,22.23 | C12.- 57.15,59.05 54.59,59.05 IC4.1 | R8.1 84.45,53.98 | C7.1 30.16,30.16 v29.84,29.84
  Top 1.016: U7.61 81.92,72.39 84.45,69.85 84.45,53.98 84.45,42.55 84.45,29.87 84.45,22.23 84.45,19.68 81.92,17.14 U8.62
  Bottom 0.305: C10.1 42.37,28.25 42.37,28.35 42.55,28.57 | U7.5 10.77,73.46 10.77,75.49 U7.6 10.77,75.69 10.77,81.28 JP11.1 | JP6.2 8.94,26.11 10.36,26.11 10.79,26.04 | U7.1 7.01,71.73 10.79,71.73 | 56.49,2.54 56.59,2.44 65.33,2.44 67.26,4.37 JP8.4 | 56.49,2.54 54.66,4.37 JP13.1 | 56.49,2.54 56.39,2.44 39.52,2.44 37.59,4.37 JP9.2 35.46,2.44 32.41,2.44 30.48,4.37 JP7.4 30.38,4.27 27.94,1.83 13.41,1.83 JP1.1 | 63.5,46.33 62.28,45.11 C6.1 | 63.5,46.33 71.12,46.33 C2.1 | C19.1 45.72,43.79 45.82,43.69 49.78,43.69 50.9,42.57 51.41,42.57 R26.1 | VGA1.10 92.96,57.91 VGA1.5 91.75,56.9 91.64,57 80.67,57 80.37,56.69 80.01,56.52 | 66.65,56.52 66.65,53.34 C9.1 | 69.9,56.52 69.9,58.42 R4.1 | C3.1 76.3,61.06 69.09,61.06 67.97,62.18 C1.1 67.87,62.28 67.26,62.28 66.95,62.59 | 66.95,62.59 C13.1 | 66.95,62.59 69.7,65.33 79.25,65.33 79.96,66.04 R12.1 | 63.5,46.33 57.2,52.63 C14.-
  Bottom 0.406: IC3.7 76.83,34.92 64.77,34.92 IC1.7
  Bottom 0.61: 42.55,28.57 U$1.4 | JP3.2 v85.72,42.55
  Bottom 0.813: 10.79,26.67 10.79,26.04 | C12.- 60.96,56.52 66.65,56.52 69.9,56.52 80.01,56.52 R8.1 | v29.84,29.84 10.79,29.84 | 10.79,19.05 12.06,19.05 12.06,27.94 C10.1
  Bottom 1.016: U8.6 10.79,19.05 10.79,26.04 10.79,29.84 10.79,71.73 U7.5
HOLD
  Bottom 0.305: U8.8 14.63,13.31 14.63,10.77 10.36,10.77 9.55,11.58 9.55,13.21 8.84,13.21 8.74,13.31 5.28,13.31 4.47,14.12 4.47,27.94 5.69,27.94 6.91,29.16 7.62,29.16 JP10.1
HSYN2
  Bottom 0.305: U8.52 69.29,14.63 70.51,15.85 82.4,15.85 83.21,15.04 83.21,10.77 91.44,10.77 93.98,13.31 JP2.5
HSYNC
  Bottom 0.305: U7.60 80.67,74.27 89.92,74.27 96.83,67.36 97.43,67.36 98.35,66.45 98.35,61.37 96.93,61.37 VGA1.13
INT
  Bottom 0.305: U8.12 19.71,13.31 19.71,2.44 15.34,2.44 14.63,3.15 14.63,7.32 8.74,7.32 3.86,12.19 3.86,33.02 6.4,33.02 7.62,34.24 JP10.5
JOY1[0]
  Top 0.305: U7.13 21.03,73.05 22.25,74.27 22.25,79.15 23.47,80.37 23.47,81.28 JP11.6
JOY1[1]
  Bottom 0.305: U7.10 17.17,74.27 18.9,74.27 19.71,75.08 19.71,81.28 JP11.5
JOY1[2]
  Top 0.305: U7.9 15.24,73.66 15.24,74.47 14.63,75.08 14.63,82.6 15.34,83.31 18.39,83.31 18.39,81.28 JP11.4
JOY1[3]
  Top 0.305: U7.11 17.17,74.27 17.17,80.06 15.95,81.28 JP11.3
JOY1[4]
  Bottom 0.305: U7.12 13.41,80.57 13.41,81.28 JP11.2
JOY2[0]
  Bottom 0.305: U8.35 48.87,11.99 41.96,5.08 41.96,4.47 JP13.6
JOY2[1]
  Top 0.305: U8.36 48.87,14.53 48.26,13.92 48.26,13.21 47.65,12.6 47.65,7.62 44.5,4.47 JP13.5
JOY2[2]
  Bottom 0.305: U8.37 51.41,11.99 47.04,7.62 47.04,4.47 JP13.4
JOY2[3]
  Top 0.305: U8.38 51.41,14.53 50.19,13.31 50.19,5.08 49.58,4.47 JP13.3
JOY2[4]
  Top 0.305: U8.39 53.95,11.99 52.12,10.16 52.12,4.47 JP13.2
KCLK
  Top 0.305: R14.1 14.63,41.25 14.63,74.17 13.41,75.39 13.41,75.49 U7.8
KDATA
  Top 0.305: R13.1 13.82,41.76 13.82,72.54 U7.7
LDAC  (via drill 0.61)
  Top 0.305: IC2.5 70.51,20.32 71.73,21.54 71.73,32.31 IC3.5 71.63,31.19 61.57,31.19 59.74,33.02 IC1.5 59.64,33.12 58.52,34.24 58.52,41.76 58.93,42.16 58.93,54.05 v59.33,54.46 | v59.33,62.89 61.27,64.82 61.27,72.64 61.57,72.95 U7.45
  Bottom 0.305: v59.33,54.46 v59.33,62.89
MISO
  Top 0.305: U8.59 80.06,11.38 80.06,4.98 80.57,4.47 JP12.3
MOSI
  Top 0.305: U8.57 78.03,10.87 78.03,4.47 JP12.4
MOSI2
  Top 0.305: IC1.4 59.74,40.64 61.06,41.96 61.06,57.2 62.38,58.52 62.38,71.22 64.11,72.95 U7.47
MOSI3
  Bottom 0.305: IC2.4 70.41,27.94 67.16,31.19 61.77,31.19 60.86,32.11 60.86,43.89 60.66,43.89 52.73,51.82 52.73,74.27 60.35,74.27 61.57,75.49 U7.46
MOSI4  (via drill 0.61)
  Top 0.305: v55.98,49.99 54.66,49.99 54.05,49.38 51.82,49.38 51.82,69.09 55.27,72.54 55.27,76.1 56.59,77.42 64.11,77.42 64.11,75.59 U7.48
  Bottom 0.305: IC3.4 69.29,42.47 66.85,42.47 65.94,41.55 65.94,38.81 64.31,38.81 63.4,39.73 63.4,43.89 61.77,43.89 55.98,49.68 v55.98,49.99
N$1  (via drill 0.61)
  Top 0.305: R4.2 77.52,58.42 77.52,54.66 R3.2 77.52,54.56 77.52,52.12 R2.2 77.52,52.02 77.52,49.58 R1.2 77.62,49.48 77.62,46.43 83.11,40.95 v83.11,23.88
  Bottom 0.305: 80.67,61.98 81.18,61.47 81.18,59.54 78.64,59.54 77.52,58.42 R4.2 | 80.67,61.98 80.57,62.08 79.76,62.08 79.05,62.79 73.56,62.79 73.05,62.28 C1.2 | v83.11,23.88 84.73,22.25 92.76,22.25 93.98,21.03 JP2.2 | VGA1.2 91.75,63.6 90.22,62.08 80.77,62.08 80.67,61.98
N$2
  Bottom 0.305: IC2.6 73.05,20.32 75.39,17.98 89.31,17.98 92.66,14.63 95.2,14.63 96.01,13.82 96.01,7.92 90.53,7.92 89.61,7.01 JP14.1
N$3
  Top 0.305: C19.2 45.72,38.71 48.87,38.71 48.87,34.95 R27.1 48.77,34.85 47.75,33.83 47.75,29.16 48.26,28.65 U$1.3
  Bottom 0.305: R27.1 48.97,34.95 51.41,34.95 R26.2 | U$1.3 48.26,23.57 45.72,21.03 U$1.5
N$4
  Top 0.305: R15.1 C15.2
N$5
  Bottom 0.305: IC3.8 79.45,32.41 80.67,33.63 93.98,33.63 JP5.1
N$6
  Top 0.305: R6.2 87.68,48.97 87.68,51.41 R7.2 87.68,51.51 87.68,53.95 R8.2 87.58,54.05 86.46,55.17 86.46,67.16 88.19,67.16 88.8,66.55 88.8,64.31 91.75,61.37 VGA1.3
  Bottom 0.305: 85.65,46.84 86.46,46.84 87.58,45.72 R5.2 87.68,45.62 96.01,45.62 96.01,20.42 95.3,19.71 95.2,19.71 93.98,18.49 JP2.3 | 85.65,46.84 76.61,46.84 76.2,46.43 C2.2 | R6.2 87.58,48.87 85.65,46.94 85.65,46.84
N$7
  Bottom 0.305: IC2.8 78.13,20.32 85.04,27.23 93.98,27.23 JP4.1
N$8
  Bottom 0.305: IC1.8 67.36,33.02 69.8,30.58 77.32,30.58 78.23,31.5 78.23,36.68 90.73,36.68 93.98,39.93 JP3.1
N$9
  Top 0.305: U$1.2 50.8,28.65 48.97,30.48 48.97,32.31 R19.1 | R18.2 57.2,29.87 60.25,29.87 R17.2 60.45,29.87 63.5,29.87 R15.2 63.6,29.87 66.65,29.87 R16.2
  Bottom 0.305: U$1.2 50.8,28.65 52.53,30.38 56.59,30.38 57.1,29.87 R18.2
N$10
  Top 0.305: R12.2 87.68,66.04 87.68,63.6 R11.2 87.68,63.5 87.68,61.06 R10.2 87.68,60.96 87.68,58.42 R9.2 87.78,58.32 88.8,57.3 88.8,50.39 96.01,43.18 96.01,25.6 93.98,23.57 JP2.1
  Bottom 0.305: C3.2 77.32,67.16 86.46,67.16 87.58,66.04 R12.2 87.68,65.94 91.75,65.94 VGA1.1
N$11
  Bottom 0.305: U$1.1 53.34,28.65 57.61,28.65 58.32,29.36 58.32,32.31 56.59,32.31 R19.2 56.49,32.51 56.49,34.85 R24.1
N$12  (via drill 0.61)
  Top 0.305: v16.87,31.09 17.27,30.68 17.27,17.48 19.71,15.04 19.71,7.62 22.86,4.47 JP7.1
  Bottom 0.305: R13.2 14.63,31.09 v16.87,31.09
N$13
  Top 0.305: R14.2 12.09,29.87 12.09,3.15 12.8,2.44 25.4,2.44 JP7.2
N$14
  Top 0.305: JP9.1 40.03,9.55 40.03,28.04 39.32,28.75 39.32,29.57 42.06,32.31 43.79,32.31 C8.-
N$15
  Bottom 0.305: R20.2 55.27,7.62 58.42,4.47 59.64,4.47 JP8.1
N$17
  Top 0.305: R21.2 65.33,7.62 62.28,4.57 62.28,4.47 JP8.2
N$18
  Bottom 0.305: R22.2 75.08,6.5 66.85,6.5 64.82,4.47 JP8.3
N$19
  Top 0.305: C8.+ 45.21,33.53 45.21,31.8 44.6,31.19 44.6,27.43 46.84,25.2 46.84,19.1 48.97,19.1 50.8,20.93 U$1.7
  Bottom 0.305: C8.+ 45.01,33.73 52.83,33.73 53.95,34.85 R23.2
N$20  (via drill 0.61)
  Top 0.305: v47.14,36.27 47.14,27.43 47.45,27.13 47.45,21.84 48.26,21.03 U$1.6 | C11.1 56.59,43.89 56.59,42.57 R24.2
  Bottom 0.305: v47.14,36.27 50.8,39.93 55.37,39.93 56.49,41.05 56.49,42.47 R24.2 56.39,42.57 54.05,42.57 R23.1
N$21
  Top 0.305: C16.2 66.65,24.79 66.65,27.23 R16.1
N$22
  Top 0.305: C17.2 60.35,24.79 60.35,27.23 R17.1
N$23
  Top 0.305: C18.2 57.2,24.79 57.2,27.23 R18.1
N$24
  Top 0.305: U7.35 47.65,74.27 47.65,79.96 48.26,80.57 JP15.2
N$85
  Top 0.305: JP15.3 50.8,77.42 48.97,75.59 U7.36
NOISEO
  Top 0.305: U8.47 62.89,13.31 62.89,15.85 60.96,15.85 57.2,19.61 C18.1
PB  (via drill 0.61)
  Top 0.305: v81.38,55.98 81.79,56.39 v81.79,70.51
  Bottom 0.305: v81.38,55.98 81.38,52.83 80.06,51.51 R7.1 | v81.79,70.51 80.57,71.73 71.32,71.73 70.51,72.54 70.51,75.49 69.29,75.49 U7.52
PG
  Top 0.305: R3.1 71.22,55.98 71.22,71.83 70.51,72.54 70.51,74.27 71.73,75.49 U7.54
PR  (via drill 0.61)
  Top 0.305: v70.21,64.31 69.29,65.23 69.29,72.95 U7.51
  Bottom 0.305: v70.21,64.31 79.15,64.31 79.96,63.5 R11.1
R
  Top 0.305: R9.1 79.96,58.42 78.03,60.35 78.03,71.73 76.91,72.85 76.91,72.95 U7.57
RD
  Top 0.305: U8.10 15.85,14.63 15.85,32 16.36,32.51 16.36,33.53 15.75,34.14 13.82,34.14 13.82,32.51 13.11,31.8 7.62,31.8 JP10.3
RESET
  Top 0.305: R25.1 6.4,23.57 6.4,26.01 JP6.1
  Bottom 0.305: U8.7 12.09,13.31 10.36,13.31 9.55,14.12 9.55,23.47 6.4,23.47 R25.1
RTC_CE
  Bottom 0.305: R20.1 62.89,7.62 65.43,10.16 65.43,13.31 73.05,13.31 74.27,14.53 U8.56
RTC_CLK
  Top 0.305: R22.1 80.67,10.77 80.67,13.31 U8.60
RTC_DATA
  Top 0.305: R21.1 73.05,7.62 73.05,12.6 73.76,13.31 76.81,13.31 76.81,14.53 U8.58
RW2  (via drill 0.61)
  Top 0.305: v32.72,26.11 32.92,26.31 32.92,39.42 U$2.17
  Bottom 0.305: v32.72,26.11 41.76,17.07 41.76,15.85 45.11,15.85 U8.34
RX
  Top 0.305: U8.9 15.85,11.99 13.41,9.55 13.41,4.47 JP1.2
SCLK
  Top 0.305: U8.55 75.08,11.28 75.08,4.88 75.49,4.47 JP12.5
SCLK2
  Top 0.305: 73.15,38.2 73.15,38.81 74.27,39.93 IC3.3 | 73.15,38.2 73.15,28.04 73.05,27.94 IC2.3 | 73.15,38.2 68.48,38.2 | 68.48,38.2 64.72,38.2 62.28,40.64 IC1.3 | U7.50 67.97,74.27 67.97,63.91 66.75,62.69 66.75,59.94 68.48,58.22 68.48,38.2
SPICS
  Top 0.305: U8.53 71.83,11.99 71.83,5.59 72.95,4.47 JP12.6
SPICS2  (via drill 0.61)
  Top 0.305: IC2.2 75.59,27.94 75.69,28.04 75.69,38.81 76.81,39.93 IC3.2 | v65.02,61.47 66.04,62.48 66.04,72.34 66.65,72.95 U7.49
  Bottom 0.305: 73.56,41.86 74.98,41.86 IC3.2 | 73.56,41.86 72.03,41.86 70.81,43.08 64.82,43.08 64.82,40.64 IC1.2 | v65.02,61.47 62.59,63.91 58.93,63.91 58.32,63.3 58.32,53.44 64.01,53.44 69.9,47.55 71.53,47.55 73.56,45.52 73.56,41.86
TX
  Top 0.305: U8.11 18.39,11.99 15.95,9.55 15.95,4.47 JP1.3
VSYN2
  Bottom 0.305: U8.51 71.12,10.16 93.37,10.16 93.98,10.77 JP2.6
VSYNC
  Top 0.305: U7.59 79.45,73.05 80.67,74.27 80.67,76.1 81.38,76.81 91.34,76.81 91.34,72.85 96.83,67.36 98.35,67.36 98.35,60.55 96.93,59.13 VGA1.14